# Altium schematic sheet Pin Headers.SchDoc
size A3; Company Name: Renesas Electronics America; CompanyURL: www.renesas.com; PageSetup: Record=PageOptions|CenterHorizontal=True|CenterVertical=True|PrintScale=1.00|XCorrection=1.00|YCorrection=1.00|PrintKind=1|BorderSize=5000000|LeftOffset=0|BottomOffset=0|Orientation=2|PaperLength=1000|PaperWidth=1000|Scale=100|PaperSource=7|PrintQuality=-4|MediaType=1|DitherType=10|PaperKind=A5 148x210mm|PrintScaleMode=1; ReleaseDate: 16.09.2025; Version: MP; SheetNumber: 12; SheetTotal: 18; VariantNumber: 0; DSheetNumber: 1
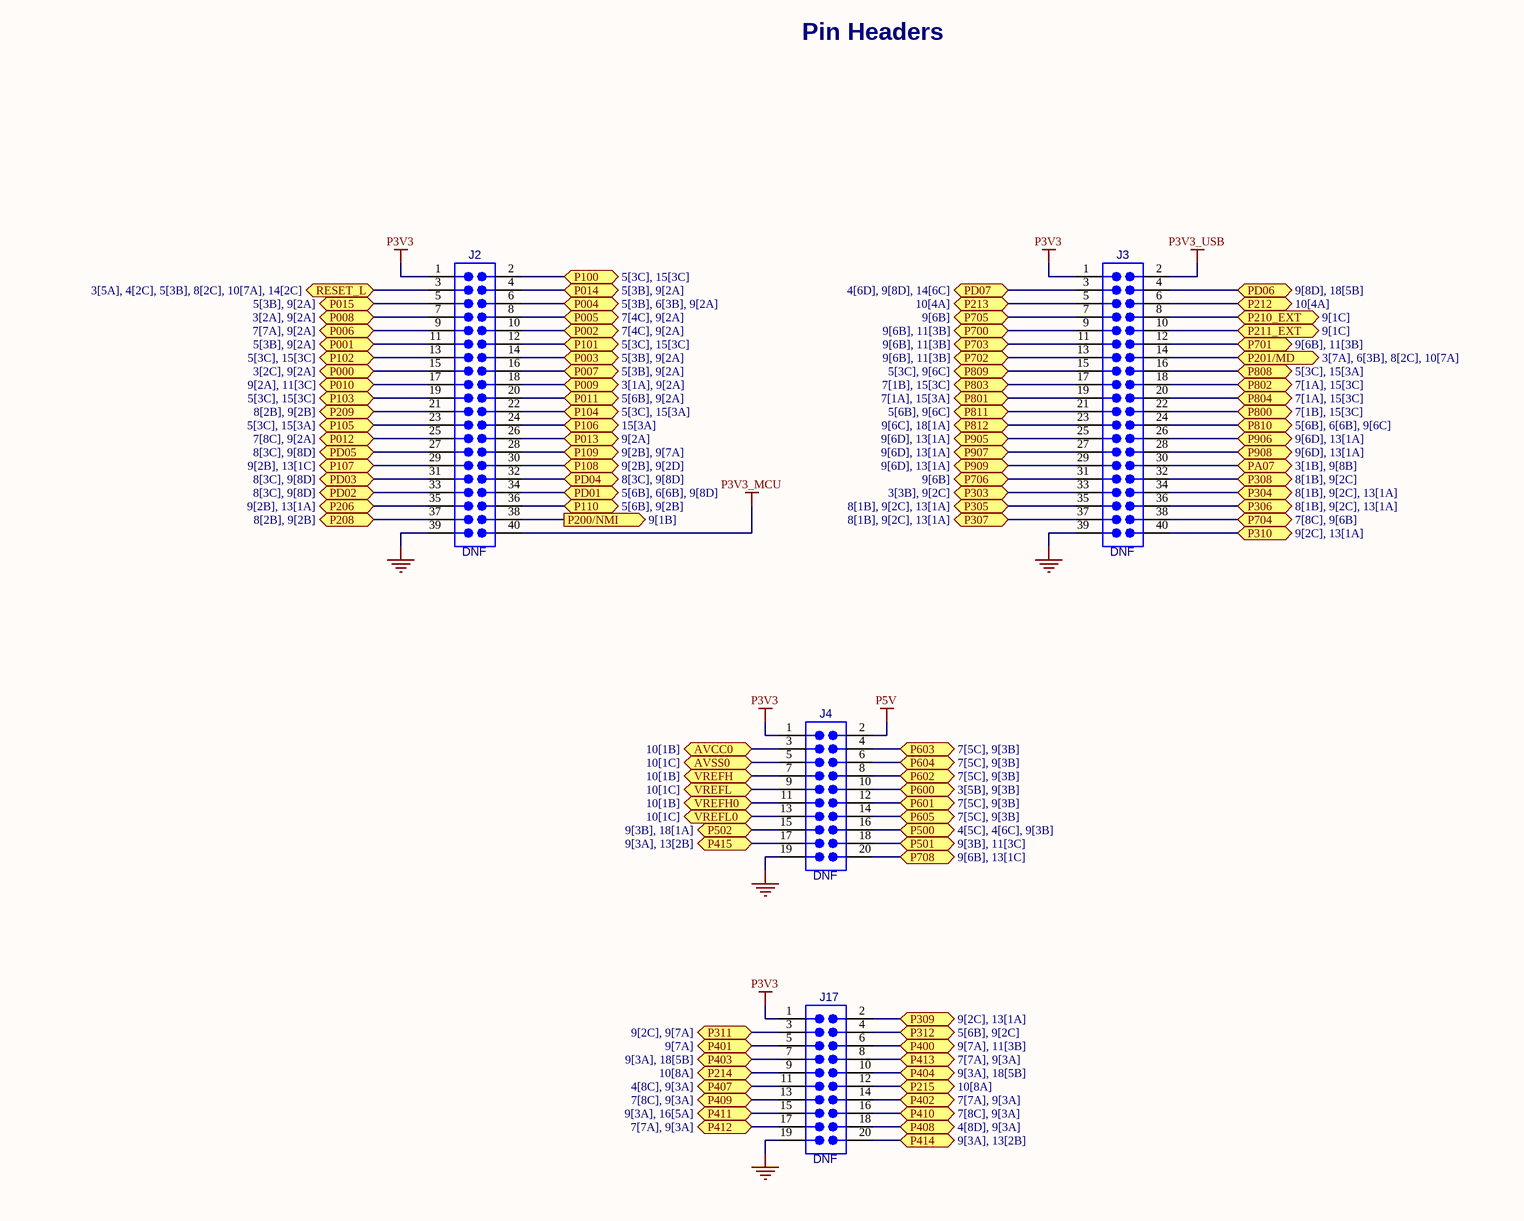
[diagram p0: Pin Headers.SchDoc]

## Parts
J2  CON_040  [wue_61304021121]  (value not drawn)
J3  CON_040  [wue_61304021121]  (value not drawn)
J4  CON_020  [wue_61302021121]  (value not drawn)
J17  CON_020  [wue_61302021121]  (value not drawn)

## Ports
AVCC0 (bidir, see 10[1B]), AVSS0 (bidir, see 10[1C]), P000 (bidir, see 3[2C], 9[2A]), P001 (bidir, see 5[3B], 9[2A]), P002 (bidir, see 7[4C], 9[2A]), P003 (bidir, see 5[3B], 9[2A]), P004 (bidir, see 5[3B], 6[3B], 9[2A]), P005 (bidir, see 7[4C], 9[2A]), P006 (bidir, see 7[7A], 9[2A]), P007 (bidir, see 5[3B], 9[2A]), P008 (bidir, see 3[2A], 9[2A]), P009 (bidir, see 3[1A], 9[2A]), P010 (bidir, see 9[2A], 11[3C]), P011 (bidir, see 5[6B], 9[2A]), P012 (bidir, see 7[8C], 9[2A]), P013 (bidir, see 9[2A]), P014 (bidir, see 5[3B], 9[2A]), P015 (bidir, see 5[3B], 9[2A]), P100 (bidir, see 5[3C], 15[3C]), P101 (bidir, see 5[3C], 15[3C]), P102 (bidir, see 5[3C], 15[3C]), P103 (bidir, see 5[3C], 15[3C]), P104 (bidir, see 5[3C], 15[3A]), P105 (bidir, see 5[3C], 15[3A]), P106 (bidir, see 15[3A]), P107 (bidir, see 9[2B], 13[1C]), P108 (bidir, see 9[2B], 9[2D]), P109 (bidir, see 9[2B], 9[7A]), P110 (bidir, see 5[6B], 9[2B]), P200/NMI (out, see 9[1B]), P201/MD (bidir, see 3[7A], 6[3B], 8[2C], 10[7A]), P206 (bidir, see 9[2B], 13[1A]), P208 (bidir, see 8[2B], 9[2B]), P209 (bidir, see 8[2B], 9[2B]), P210_EXT (bidir, see 9[1C]), P211_EXT (bidir, see 9[1C]), P212 (bidir, see 10[4A]), P213 (bidir, see 10[4A]), P214 (bidir, see 10[8A]), P215 (bidir, see 10[8A]), P303 (bidir, see 3[3B], 9[2C]), P304 (bidir, see 8[1B], 9[2C], 13[1A]), P305 (bidir, see 8[1B], 9[2C], 13[1A]), P306 (bidir, see 8[1B], 9[2C], 13[1A]), P307 (bidir, see 8[1B], 9[2C], 13[1A]), P308 (bidir, see 8[1B], 9[2C]), P309 (bidir, see 9[2C], 13[1A]), P310 (bidir, see 9[2C], 13[1A]), P311 (bidir, see 9[2C], 9[7A]), P312 (bidir, see 5[6B], 9[2C]), P400 (bidir, see 9[7A], 11[3B]), P401 (bidir, see 9[7A]), P402 (bidir, see 7[7A], 9[3A]), P403 (bidir, see 9[3A], 18[5B]), P404 (bidir, see 9[3A], 18[5B]), P407 (bidir, see 4[8C], 9[3A]), P408 (bidir, see 4[8D], 9[3A]), P409 (bidir, see 7[8C], 9[3A]), P410 (bidir, see 7[8C], 9[3A]), P411 (bidir, see 9[3A], 16[5A]), P412 (bidir, see 7[7A], 9[3A]), P413 (bidir, see 7[7A], 9[3A]), P414 (bidir, see 9[3A], 13[2B]), P415 (bidir, see 9[3A], 13[2B]), P500 (bidir, see 4[5C], 4[6C], 9[3B]), P501 (bidir, see 9[3B], 11[3C]), P502 (bidir, see 9[3B], 18[1A]), P600 (bidir, see 3[5B], 9[3B]), P601 (bidir, see 7[5C], 9[3B]), P602 (bidir, see 7[5C], 9[3B]), P603 (bidir, see 7[5C], 9[3B]), P604 (bidir, see 7[5C], 9[3B]), P605 (bidir, see 7[5C], 9[3B]), P700 (bidir, see 9[6B], 11[3B]), P701 (bidir, see 9[6B], 11[3B]), P702 (bidir, see 9[6B], 11[3B]), P703 (bidir, see 9[6B], 11[3B]), P704 (bidir, see 7[8C], 9[6B]), P705 (bidir, see 9[6B]), P706 (bidir, see 9[6B]), P708 (bidir, see 9[6B], 13[1C]), P800 (bidir, see 7[1B], 15[3C]), P801 (bidir, see 7[1A], 15[3A]), P802 (bidir, see 7[1A], 15[3C]), P803 (bidir, see 7[1B], 15[3C]), P804 (bidir, see 7[1A], 15[3C]), P808 (bidir, see 5[3C], 15[3A]), P809 (bidir, see 5[3C], 9[6C]), P810 (bidir, see 5[6B], 6[6B], 9[6C]), P811 (bidir, see 5[6B], 9[6C]), P812 (bidir, see 9[6C], 18[1A]), P905 (bidir, see 9[6D], 13[1A]), P906 (bidir, see 9[6D], 13[1A]), P907 (bidir, see 9[6D], 13[1A]), P908 (bidir, see 9[6D], 13[1A]), P909 (bidir, see 9[6D], 13[1A]), PA07 (bidir, see 3[1B], 9[8B]), PD01 (bidir, see 5[6B], 6[6B], 9[8D]), PD02 (bidir, see 8[3C], 9[8D]), PD03 (bidir, see 8[3C], 9[8D]), PD04 (bidir, see 8[3C], 9[8D]), PD05 (bidir, see 8[3C], 9[8D]), PD06 (bidir, see 9[8D], 18[5B]), PD07 (bidir, see 4[6D], 9[8D], 14[6C]), RESET_L (bidir, see 3[5A], 4[2C], 5[3B], 8[2C], 10[7A], 14[2C]), VREFH0 (bidir, see 10[1B]), VREFH (bidir, see 10[1B]), VREFL0 (bidir, see 10[1C]), VREFL (bidir, see 10[1C])

## Nets
GND: J2.39 J3.39 J4.19 J17.19
P3V3: J2.1 J3.1 J4.1 J17.1
P3V3_MCU: J2.40
P3V3_USB: J3.2
P5V: J4.2
AVCC0: J4.3 ; port AVCC0
AVSS0: J4.5 ; port AVSS0
P000: J2.15 ; port P000
P001: J2.11 ; port P001
P002: J2.10 ; port P002
P003: J2.14 ; port P003
P004: J2.6 ; port P004
P005: J2.8 ; port P005
P006: J2.9 ; port P006
P007: J2.16 ; port P007
P008: J2.7 ; port P008
P009: J2.18 ; port P009
P010: J2.17 ; port P010
P011: J2.20 ; port P011
P012: J2.25 ; port P012
P013: J2.26 ; port P013
P014: J2.4 ; port P014
P015: J2.5 ; port P015
P100: J2.2 ; port P100
P101: J2.12 ; port P101
P102: J2.13 ; port P102
P103: J2.19 ; port P103
P104: J2.22 ; port P104
P105: J2.23 ; port P105
P106: J2.24 ; port P106
P107: J2.29 ; port P107
P108: J2.30 ; port P108
P109: J2.28 ; port P109
P110: J2.36 ; port P110
P200/NMI: J2.38 ; port P200/NMI
P201/MD: J3.14 ; port P201/MD
P206: J2.35 ; port P206
P208: J2.37 ; port P208
P209: J2.21 ; port P209
P210_EXT: J3.8 ; port P210_EXT
P211_EXT: J3.10 ; port P211_EXT
P212: J3.6 ; port P212
P213: J3.5 ; port P213
P214: J17.9 ; port P214
P215: J17.12 ; port P215
P303: J3.33 ; port P303
P304: J3.34 ; port P304
P305: J3.35 ; port P305
P306: J3.36 ; port P306
P307: J3.37 ; port P307
P308: J3.32 ; port P308
P309: J17.2 ; port P309
P310: J3.40 ; port P310
P311: J17.3 ; port P311
P312: J17.4 ; port P312
P400: J17.6 ; port P400
P401: J17.5 ; port P401
P402: J17.14 ; port P402
P403: J17.7 ; port P403
P404: J17.10 ; port P404
P407: J17.11 ; port P407
P408: J17.18 ; port P408
P409: J17.13 ; port P409
P410: J17.16 ; port P410
P411: J17.15 ; port P411
P412: J17.17 ; port P412
P413: J17.8 ; port P413
P414: J17.20 ; port P414
P415: J4.17 ; port P415
P500: J4.16 ; port P500
P501: J4.18 ; port P501
P502: J4.15 ; port P502
P600: J4.10 ; port P600
P601: J4.12 ; port P601
P602: J4.8 ; port P602
P603: J4.4 ; port P603
P604: J4.6 ; port P604
P605: J4.14 ; port P605
P700: J3.9 ; port P700
P701: J3.12 ; port P701
P702: J3.13 ; port P702
P703: J3.11 ; port P703
P704: J3.38 ; port P704
P705: J3.7 ; port P705
P706: J3.31 ; port P706
P708: J4.20 ; port P708
P800: J3.22 ; port P800
P801: J3.19 ; port P801
P802: J3.18 ; port P802
P803: J3.17 ; port P803
P804: J3.20 ; port P804
P808: J3.16 ; port P808
P809: J3.15 ; port P809
P810: J3.24 ; port P810
P811: J3.21 ; port P811
P812: J3.23 ; port P812
P905: J3.25 ; port P905
P906: J3.26 ; port P906
P907: J3.27 ; port P907
P908: J3.28 ; port P908
P909: J3.29 ; port P909
PA07: J3.30 ; port PA07
PD01: J2.34 ; port PD01
PD02: J2.33 ; port PD02
PD03: J2.31 ; port PD03
PD04: J2.32 ; port PD04
PD05: J2.27 ; port PD05
PD06: J3.4 ; port PD06
PD07: J3.3 ; port PD07
RESET_L: J2.3 ; port RESET_L
VREFH: J4.7 ; port VREFH
VREFH0: J4.11 ; port VREFH0
VREFL: J4.9 ; port VREFL
VREFL0: J4.13 ; port VREFL0

## Notes on the sheet
- Pin Headers
- www.renesas.com <http://www.renesas.com>
- Sheet:
- Title:
- Document Number:
- Version:
- Variant:
- Renesas Electronics
- Size:
- A3
- Date:
- Time:
- Page:
- of
- Product Issue:

## Library data of the parts
J2 = CON-00003310-13: Header,40way,2row,vertical,2.54mm,THT; Gender: male; Current: 3A; DC Resistance: 20m; Operating Voltage Max: 250V; Height: 8.89mm; Operating Temperature Max: 105°C; Operating Temperature Min: -40°C; Pin Count: 40; Qualification: -; DNF: DNF
J3 = CON-00003310-13: Header,40way,2row,vertical,2.54mm,THT; Current: 3A; DC Resistance: 20m; Gender: male; Operating Voltage Max: 250V; Height: 8.89mm; Operating Temperature Max: 105°C; Operating Temperature Min: -40°C; Pin Count: 40; Qualification: -; DNF: DNF
J4 J17 = CON-00003301-13: Header,20way,2row,vertical,2.54mm,THT; Current: 3A; DC Resistance: 20m; Gender: male; Operating Voltage Max: 250V; Height: 8.89mm; Operating Temperature Max: 105°C; Operating Temperature Min: -40°C; Pin Count: 20; Qualification: -; DNF: DNF